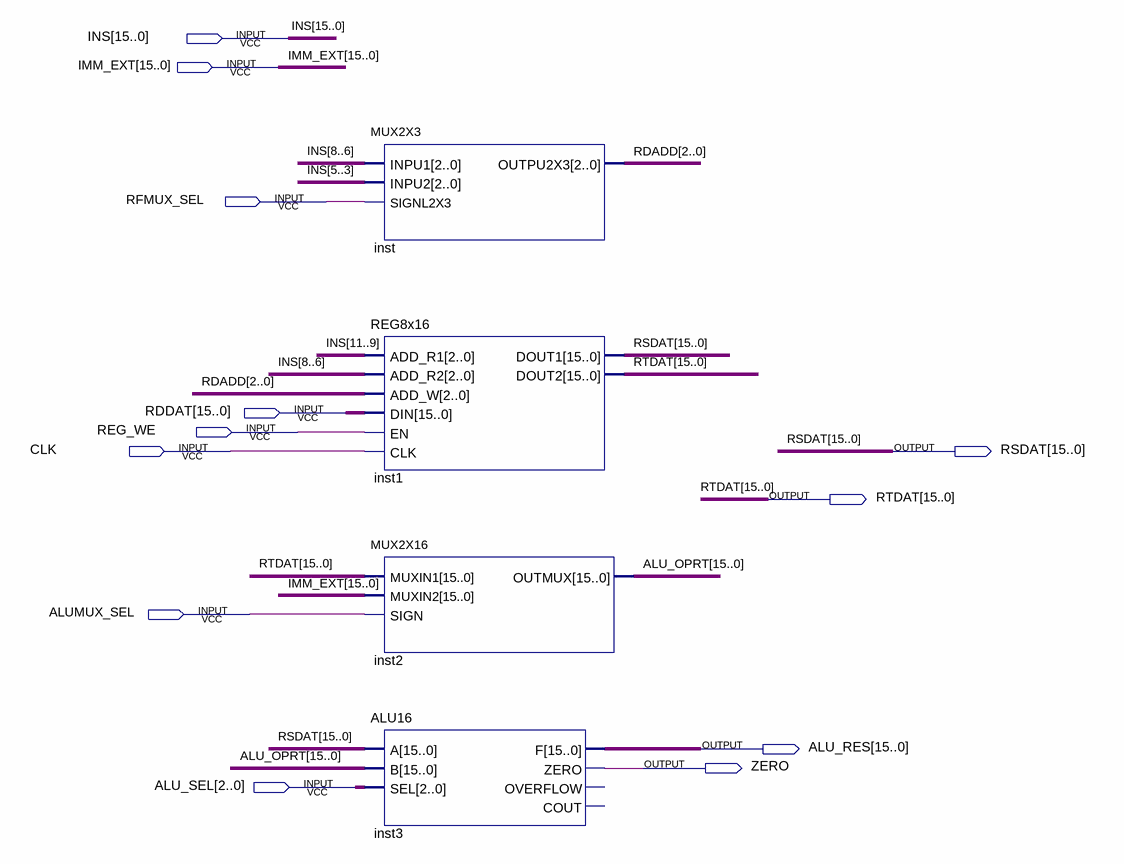
[diagram p0: schematic sheet]
// Quartus schematic Level3.bdf as structural Verilog: 4 symbols, 12 pins
module Level3 (
  input  [15:0] INS,
  input  [15:0] IMM_EXT,
  input  RFMUX_SEL,
  input  [15:0] RDDAT,
  input  REG_WE,
  input  CLK,
  input  ALUMUX_SEL,
  input  [2:0] ALU_SEL,
  output [15:0] RSDAT,
  output [15:0] RTDAT,
  output [15:0] ALU_RES,
  output ZERO
);

  wire [2:0] RDADD;
  wire [15:0] ALU_OPRT;

  MUX2X3 inst (.INPU1(INS[8:6]), .INPU2(INS[5:3]), .SIGNL2X3(RFMUX_SEL), .OUTPU2X3(RDADD));
  REG8x16 inst1 (
    .ADD_R1(INS[11:9]), .ADD_R2(INS[8:6]), .ADD_W(RDADD), .DIN(RDDAT), .EN(REG_WE), .CLK(CLK), .DOUT1(RSDAT),
    .DOUT2(RTDAT));
  MUX2X16 inst2 (.MUXIN1(RTDAT), .MUXIN2(IMM_EXT), .SIGN(ALUMUX_SEL), .OUTMUX(ALU_OPRT));
  ALU16 inst3 (.A(RSDAT), .B(ALU_OPRT), .SEL(ALU_SEL), .F(ALU_RES), .ZERO(ZERO));  // open: OVERFLOW, COUT
endmodule
